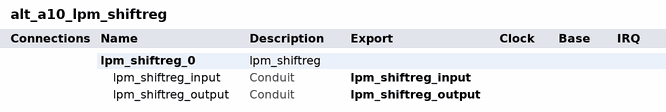
[diagram p0: system contents]
# Platform Designer (Qsys) system alt_a10_lpm_shiftreg, Arria 10 10AX115S3F45E2SG
# Parameters at their usual value, and those the tool derives, are not listed.
package require qsys
create_system alt_a10_lpm_shiftreg
set_project_property DEVICE_FAMILY {Arria 10}
set_project_property DEVICE 10AX115S3F45E2SG

add_instance lpm_shiftreg_0 lpm_shiftreg 16.0
set_instance_property lpm_shiftreg_0 AUTO_EXPORT true
set_instance_parameter_value lpm_shiftreg_0 GUI_ASET_VALUE 0
set_instance_parameter_value lpm_shiftreg_0 GUI_DIRECTION Left
set_instance_parameter_value lpm_shiftreg_0 GUI_SSET_VALUE 0
set_instance_parameter_value lpm_shiftreg_0 GUI_USE_ACLR_INPUT false
set_instance_parameter_value lpm_shiftreg_0 GUI_USE_ASET_INPUT false
set_instance_parameter_value lpm_shiftreg_0 GUI_USE_ASET_INPUT_1s false
set_instance_parameter_value lpm_shiftreg_0 GUI_USE_CLKEN_INPUT false
set_instance_parameter_value lpm_shiftreg_0 GUI_USE_DATA_OUTPUT false
set_instance_parameter_value lpm_shiftreg_0 GUI_USE_PARALLEL_INPUT false
set_instance_parameter_value lpm_shiftreg_0 GUI_USE_SCLR_INPUT false
set_instance_parameter_value lpm_shiftreg_0 GUI_USE_SERIAL_INPUT true
set_instance_parameter_value lpm_shiftreg_0 GUI_USE_SERIAL_OUTPUT true
set_instance_parameter_value lpm_shiftreg_0 GUI_USE_SSET_INPUT false
set_instance_parameter_value lpm_shiftreg_0 GUI_USE_SSET_INPUT_1s false
set_instance_parameter_value lpm_shiftreg_0 GUI_WIDTH 16

# exported interfaces
add_interface lpm_shiftreg_input conduit end
set_interface_property lpm_shiftreg_input EXPORT_OF lpm_shiftreg_0.lpm_shiftreg_input
add_interface lpm_shiftreg_output conduit end
set_interface_property lpm_shiftreg_output EXPORT_OF lpm_shiftreg_0.lpm_shiftreg_output

set_interconnect_requirement {$system} qsys_mm.clockCrossingAdapter HANDSHAKE
set_interconnect_requirement {$system} qsys_mm.enableEccProtection FALSE
set_interconnect_requirement {$system} qsys_mm.insertDefaultSlave FALSE
set_interconnect_requirement {$system} qsys_mm.maxAdditionalLatency 1

save_system alt_a10_lpm_shiftreg.qsys
